# EAGLE design RFID MFRC522 (EAGLE 9.1.0)
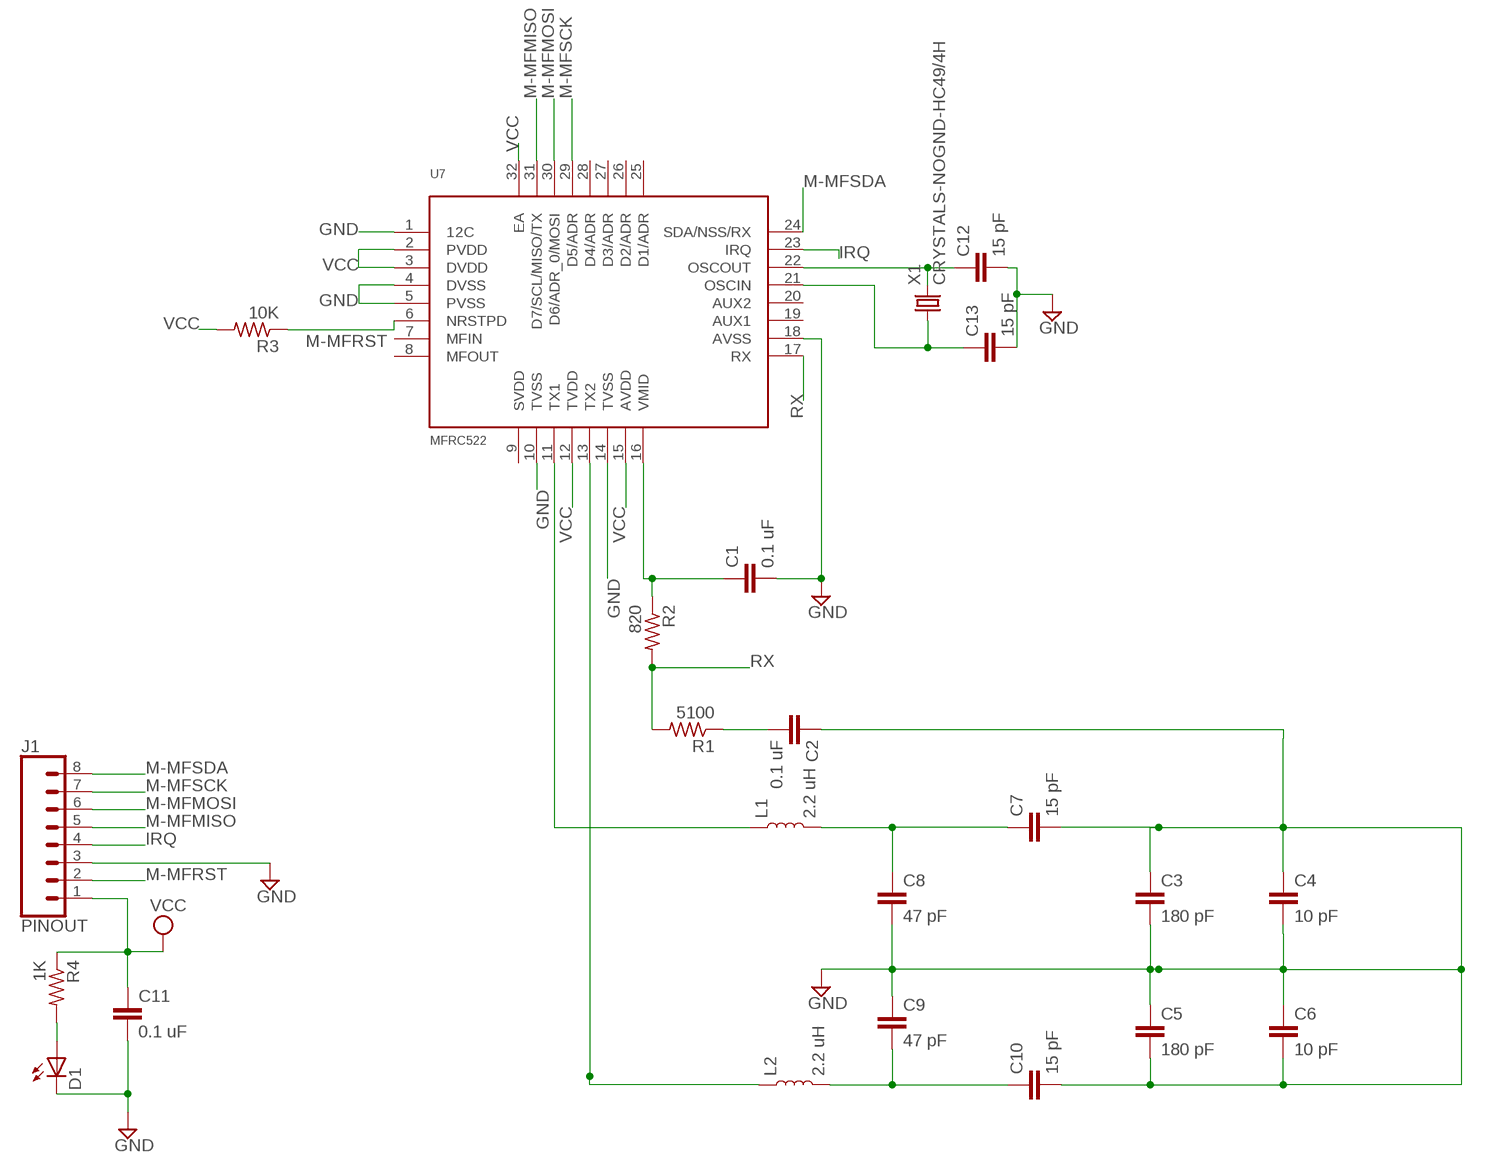
[diagram p0: schematic, sheet 1]

## Parts
C1  0.1 uF  C-EUC0603  [C0603]
C2  0.1 uF  C-EUC0603  [C0603]
C3  180 pF  C-EUC0603  [C0603]
C4  10 pF  C-EUC0603  [C0603]
C5  180 pF  C-EUC0603  [C0603]
C6  10 pF  C-EUC0603  [C0603]
C7  15 pF  C-EUC0603  [C0603]
C8  47 pF  C-EUC0603  [C0603]
C9  47 pF  C-EUC0603  [C0603]
C10  15 pF  C-EUC0603  [C0603]
C11  0.1 uF  C-EUC0603  [C0603]
C12  15 pF  C-EUC0603  [C0603]
C13  15 pF  C-EUC0603  [C0603]
D1  LED  [C1210]
J1  PINOUT  CONN_08NO_SILK_FEMALE_PTH  [1X08_NO_SILK]
L1  2.2 uH  INDUCTOR-0603-33NH  [0603]
L2  2.2 uH  INDUCTOR-0603-33NH  [0603]
R1  5100  R-US_R0603  [R0603]
R2  820  R-US_R0603  [R0603]
R3  10K  R-US_R0603  [R0603]
R4  1K  R-US_R0603  [R0603]
U7  MFRC522  [MFR522]
X1  CRYSTALS-NOGND-HC49/4H  [HC49]

## Nets
GND: C1.2 C2.1 C3.1 C3.2 C4.1 C4.2 C5.1 C5.2 C6.1 C6.2 C7.2 C8.2 C9.1 C10.2 C11.2 C12.2 C13.2 D1.C J1.3 U7.1(12C) U7.4(DVSS) U7.5(PVSS) U7.10(TVSS) U7.14(TVSS) U7.18(AVSS)
IRQ: J1.4 U7.23(IRQ)
M-MFMISO: J1.5 U7.31(D7/SCL/MISO/TX)
M-MFMOSI: J1.6 U7.30(D6/ADR_0/MOSI)
M-MFRST: J1.2 R3.1 U7.6(NRSTPD)
M-MFSCK: J1.7 U7.29(D5/ADR)
M-MFSDA: J1.8 U7.24(SDA/NSS/RX)
N$1: D1.A R4.2
N$5: C2.2 R1.1
N$10: C9.2 C10.1 L2.2
N$12: C7.1 C8.1 L1.2
OSCIN: C13.1 U7.21(OSCIN) X1.1
OSCOUT: C12.1 U7.22(OSCOUT) X1.2
RX: R1.2 R2.2 U7.17(RX)
TX1: L1.1 U7.11(TX1)
TX2: L2.1 U7.13(TX2)
VCC: C11.1 J1.1 R3.2 R4.1 U7.2(PVDD) U7.3(DVDD) U7.12(TVDD) U7.15(AVDD) U7.32(EA)
VMID: C1.1 R2.1 U7.16(VMID)
Unconnected: U7.7(MFIN) U7.8(MFOUT) U7.9(SVDD) U7.19(AUX1) U7.20(AUX2) U7.25(D1/ADR) U7.26(D2/ADR) U7.27(D3/ADR) U7.28(D4/ADR)

## Library data of the parts
C1-C13 = rcl:C-EU: CAPACITOR, European symbol; SPICEPREFIX: C
D1 = RFID Reader Part Library:LED
J1 = SparkFun-Connectors:CONN_08: Multi connection point. Often used as Generic Header-pin footprint for 0.1 inch spaced/style header connections On any of the 0.1 inch spaced packages, you can populate with these: Break Away Headers - Straight <https://www.sparkfun.com/products/116> (PRT-00116) Break Away Male Headers - Right Angle <https://www.sparkfun.com/products/553> (PRT-00553) Female Headers <https://www.sparkfun.com/products/115> (PRT-00115) Break Away Headers - Machine Pin <https://www.sparkfun.com/products/117> (PRT-00117) Break Away Female Headers - Swiss Machine Pin <https://www.sparkfun.com/products/743> (PRT-00743) Arduino Stackable Header - 8 Pin <https://www.sparkfun.com/products/9279> (PRT-09279) For SCREWTERMINALS and SPRING TERMINALS visit here: Screw Terimnals on SparkFun.com <https://www.sparkfun.com/search/results?term=Screw+Terminals> (5mm/3.5mm/2.54mm spacing) This device is also useful as a general connection point to wire up your design to another part of your project. Our various solder wires solder well into these plated through hole pads. Hook-Up Wire - Assortment (Stranded, 22 AWG) <https://www.sparkfun.com/products/11375> (PRT-11375) Hook-Up Wire - Assortment (Solid Core, 22 AWG) <https://www.sparkfun.com/products/11367> (PRT-11367) View the entire wire category on our website here <https://www.sparkfun.com/categories/141> Special notes: Molex polarized connector foot print use with SKU : PRT-08231 with associated crimp pins and housings. 1MM SMD Version SKU: PRT-10208 NOTES ON THE VARIANTS LOCK and LOCK_LONGPADS... This footprint was designed to help hold the alignment of a through-hole component (i.e. 6-pin header) while soldering it into place. You may notice that each hole has been shifted either up or down by 0.005 of an inch from it's more standard position (which is a perfectly straight line). This slight alteration caused the pins (the squares in the middle) to touch the edges of the holes. Because they are alternating, it causes a "brace" to hold the component in place. 0.005 has proven to be the perfect amount of "off-center" position when using our standard breakaway headers. Although looks a little odd when you look at the bare footprint, once you have a header in there, the alteration is very hard to notice. Also,if you push a header all the way into place, it is covered up entirely on the bottom side.; PROD_ID: CONN-08438
L1 L2 = SparkFun-Coils:INDUCTOR: Inductors Resist changes in electrical current. Basically a coil of wire. SparkFun Products: SparkFun Load Cell Amplifier - HX711 <https://www.sparkfun.com/products/13879> IOIO-OTG - V2.2 <https://www.sparkfun.com/products/13613>; PROD_ID: NDUC-07874; VALUE: 33nH/±5%/500mA
R1-R4 = rcl:R-US_: RESISTOR, American symbol; SPICEPREFIX: R
U7 = mfrc:MFRC522
X1 = IQD-Frequency-Products:CRYSTALS-NOGND: CRYSTALS CAN NOT GROUNDED

## Board
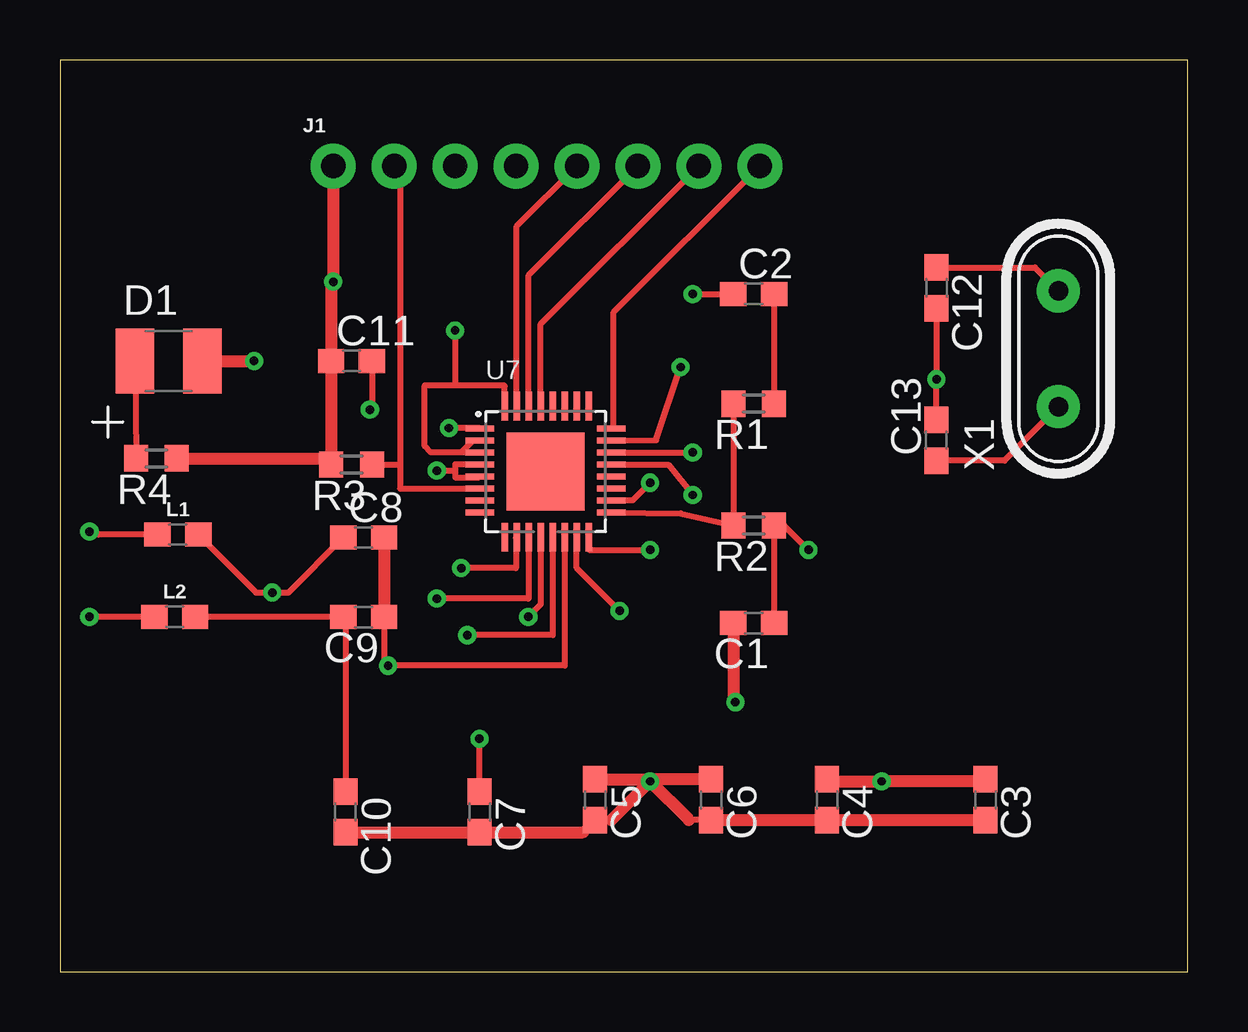
[diagram p1: board, top side]
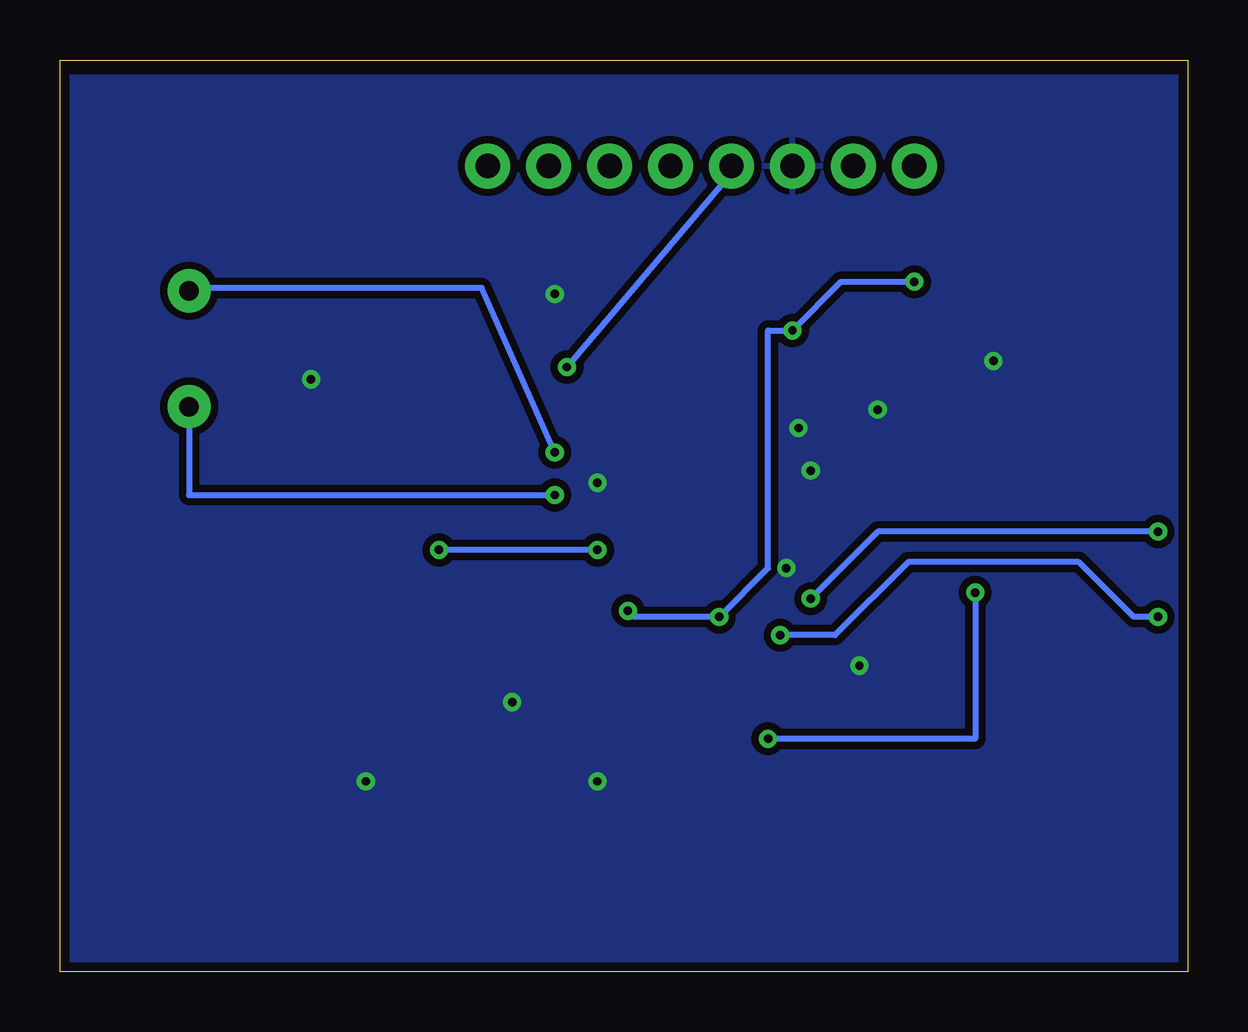
[diagram p2: board, bottom side, seen from below]

Size 47 x 38 mm. Coordinates in mm from the lower left corner, seen from the top.
Outline: 0,0 47,0 47,38 0,38 0,0
Copper layers (1*16): Top 0.0178mm / dielectric 59mil / Bottom 0.0178mm
Design rules "epl-lpkf": minimum track width 8mil, minimum drill 0.35mm, track to track 8mil, track to pad 8mil, pad to pad 8mil, via to via 8mil, smd to smd 8mil, copper to edge 15mil, drill to drill 15mil, minimum pad ring 8mil, minimum via ring 8mil, stop-mask expansion 3mil, vias tented up to drill 0mil, thermal gap 10mil

### Footprints (pad centres in the part's own frame; a part is rotated, then mirrored left to right if it is on the bottom)
C0603 = smd 1.1 x 1: 1 -0.85,0; 2 0.85,0
C1210 = smd 1.6 x 2.7: A -1.4,0; C 1.4,0
1X08_NO_SILK = drill 1.016 pad 1.88: 1 0,0; 2 2.54,0; 3 5.08,0; 4 7.62,0; 5 10.16,0; 6 12.7,0; 7 15.24,0; 8 17.78,0
0603 = smd 1.1 x 1: 1 -0.85,0; 2 0.85,0
R0603 = smd 1 x 1.1: 1 -0.85,0; 2 0.85,0
MFR522 = smd 1.2 x 0.254: 1 -0.236,4.3; 2 -0.236,3.8; 3 -0.236,3.3; 4 -0.236,2.8; 5 -0.236,2.3; 6 -0.236,1.8; 7 -0.236,1.3; 8 -0.236,0.8; 17 5.237,0.8; 18 5.237,1.3; 19 5.237,1.8; 20 5.237,2.3; 21 5.237,2.8; 22 5.237,3.3; 23 5.237,3.8; 24 5.237,4.3 | smd 0.254 x 1.2: 9 0.8,-0.236; 10 1.3,-0.236; 11 1.8,-0.236; 12 2.3,-0.236; 13 2.8,-0.236; 14 3.3,-0.236; 15 3.8,-0.236; 16 4.3,-0.236; 25 4.3,5.237; 26 3.8,5.237; 27 3.3,5.237; 28 2.8,5.237; 29 2.3,5.237; 30 1.8,5.237; 31 1.3,5.237; 32 0.8,5.237 | smd 3.25 x 3.25: P$1 2.5,2.5
HC49 = drill 0.813 pad 1.8: 1 -2.413,0; 2 2.413,0

### Placement (x,y rotation side)
C1  28.92,14.53 180 top
C2  28.92,28.25 0 top
C3  38.57,7.16 270 top
C4  31.96,7.16 270 top
C5  22.31,7.16 270 top
C6  27.14,7.16 270 top
C7  17.49,6.66 270 top
C8  12.66,18.09 0 top
C9  12.66,14.78 180 top
C10  11.9,6.66 270 top
C11  12.15,25.45 0 top
C12  36.54,28.5 270 top
C13  36.54,22.15 90 top
D1  4.53,25.45 0 top
J1  11.39,33.58 0 top
L1  4.91,18.21 0 top
L2  4.79,14.78 0 top
R1  28.92,23.67 180 top
R2  28.92,18.59 180 top
R3  12.15,21.13 180 top
R4  4.02,21.39 180 top
U7  17.74,18.34 0 top
X1  41.62,25.96 90 top

### Tracks (layer width: path | path; a pad name or v marks a point on that pad's centre or on a via)
GND  (via drill 0.35)
  Top 0.254: C12.2 v36.54,24.69 C13.2 | U7.18 23.87,19.64 v24.6,20.37 | U7.1 17.49,22.66 v16.22,22.66 | 19.01,18.07 U7.10 19.01,18.07 | U7.14 21.04,12.75 v13.68,12.75 13.51,12.92 C9.1 | 28.07,11.32 v28.15,11.23 | 21.8,5.81 C5.2 22.99,6.31 | C4.1 32.05,7.93 | 34,7.93 v34.25,7.93 | 24.69,8.01 v24.6,7.93 24.51,8.01 | C11.2 13,23.51 v12.91,23.42 | 19.01,18.07 19.01,16.82 v16.72,16.82 | v26.38,28.25 C2.1 | C6.2 26.21,6.31 | U7.4 16.48,21.14 16.47,21.13 16.47,20.88 | 16.47,20.88 16.47,20.6 17.46,20.6 U7.5 | v15.71,20.88 16.47,20.88 | C3.1 38.48,7.93
  Top 0.5: C8.2 C9.1 | D1.C v8.09,25.45 | C1.2 28.07,11.32 | C10.2 C7.2 21.8,5.81 | C6.2 C4.2 C3.2 | 32.05,7.93 34,7.93 38.48,7.93 | C5.1 24.69,8.01 | C6.1 24.51,8.01 | 22.99,6.31 v24.6,7.93 26.21,6.31
  pour Bottom (isolate 0.305): 0,37.33 47.02,37.33 47.02,0 0,0
IRQ  (via drill 0.35)
  Top 0.254: U7.23 24.85,22.15 v25.87,25.2
  Bottom 0.254: J1.4 19.01,33.28 v25.87,25.2
M-MFMISO
  Top 0.254: U7.31 19.04,31.07 J1.5
M-MFMOSI
  Top 0.254: U7.30 19.54,29.03 J1.6
M-MFRST
  Top 0.254: J1.2 arc-90 14.18,33.33 14.18,21.13 | 14.18,21.13 14.18,20.12 arc-90 14.21,20.14 U7.6 | R3.1 14.18,21.13
M-MFSCK
  Top 0.254: U7.29 20.04,26.99 J1.7
M-MFSDA
  Top 0.254: U7.24 23.07,22.74 23.07,27.48 J1.8
N$1
  Top 0.254: D1.A R4.2
N$5
  Top 0.254: C2.2 R1.1
N$10
  Top 0.254: L2.2 C9.2 arc-90 11.9,14.7 C10.1
N$12  (via drill 0.35)
  Top 0.254: 8.18,15.8 v8.85,15.8 | v8.85,15.8 9.52,15.8 C8.1 | C7.1 v17.49,9.7 | L1.2 8.18,15.8 | 8.18,15.8 v8.85,15.8
  Bottom 0.254: v8.85,15.8 8.85,9.7 v17.49,9.7
OSCIN  (via drill 0.35)
  Top 0.254: X1.1 39.37,21.3 C13.1 | U7.21 25.36,21.13 v26.38,19.86
  Bottom 0.254: X1.1 41.62,19.86 v26.38,19.86
OSCOUT  (via drill 0.35)
  Top 0.254: U7.22 v26.38,21.64 | C12.1 40.64,29.35 X1.2
  Bottom 0.254: v26.38,21.64 29.42,28.5 41.49,28.5 X1.2
RX
  Top 0.254: R1.2 R2.2 25.87,19.1 U7.17
TX1  (via drill 0.35)
  Top 0.254: L1.1 1.61,18.21 1.48,18.34 v1.23,18.34 | U7.11 19.54,15.57 19.52,15.55 v15.71,15.55
  Bottom 0.254: v1.23,18.34 12.91,18.34 v15.71,15.55
TX2  (via drill 0.35)
  Top 0.254: L2.1 v1.23,14.78 | U7.13 20.54,14.03 20.53,14.02 v16.98,14.02
  Bottom 0.254: v1.23,14.78 2.25,14.78 4.53,17.07 11.64,17.07 14.69,14.02 v16.98,14.02
VCC  (via drill 0.35)
  Top 0.254: U7.32 18.54,24.4 18.5,24.44 16.47,24.44 | 16.47,24.44 15.2,24.44 15.2,21.9 15.46,21.64 16.72,21.64 | 11.3,21.39 R3.2 | v16.47,26.72 16.47,24.44 | v11.39,28.75 11.3,28.67 | U7.12 20.04,15.31 v19.52,14.78 | v23.33,15.04 21.54,16.83 U7.15 | U7.3 16.72,21.64 | U7.2 17.22,22.14 16.72,21.64
  Top 0.5: R4.1 11.3,21.39 C11.1 11.3,28.67 | J1.1 v11.39,28.75
  Bottom 0.254: v11.39,28.75 14.44,28.75 v16.47,26.72 17.49,26.72 17.49,16.82 v19.52,14.78 23.07,14.78 v23.33,15.04
VMID  (via drill 0.35)
  Top 0.254: C1.1 R2.1 30.19,18.59 v31.2,17.58 | U7.16 22.06,18.09 22.06,17.58 v24.6,17.58
  Bottom 0.254: v24.6,17.58 v31.2,17.58